# EAGLE design esquematico (EAGLE 8.5.2)
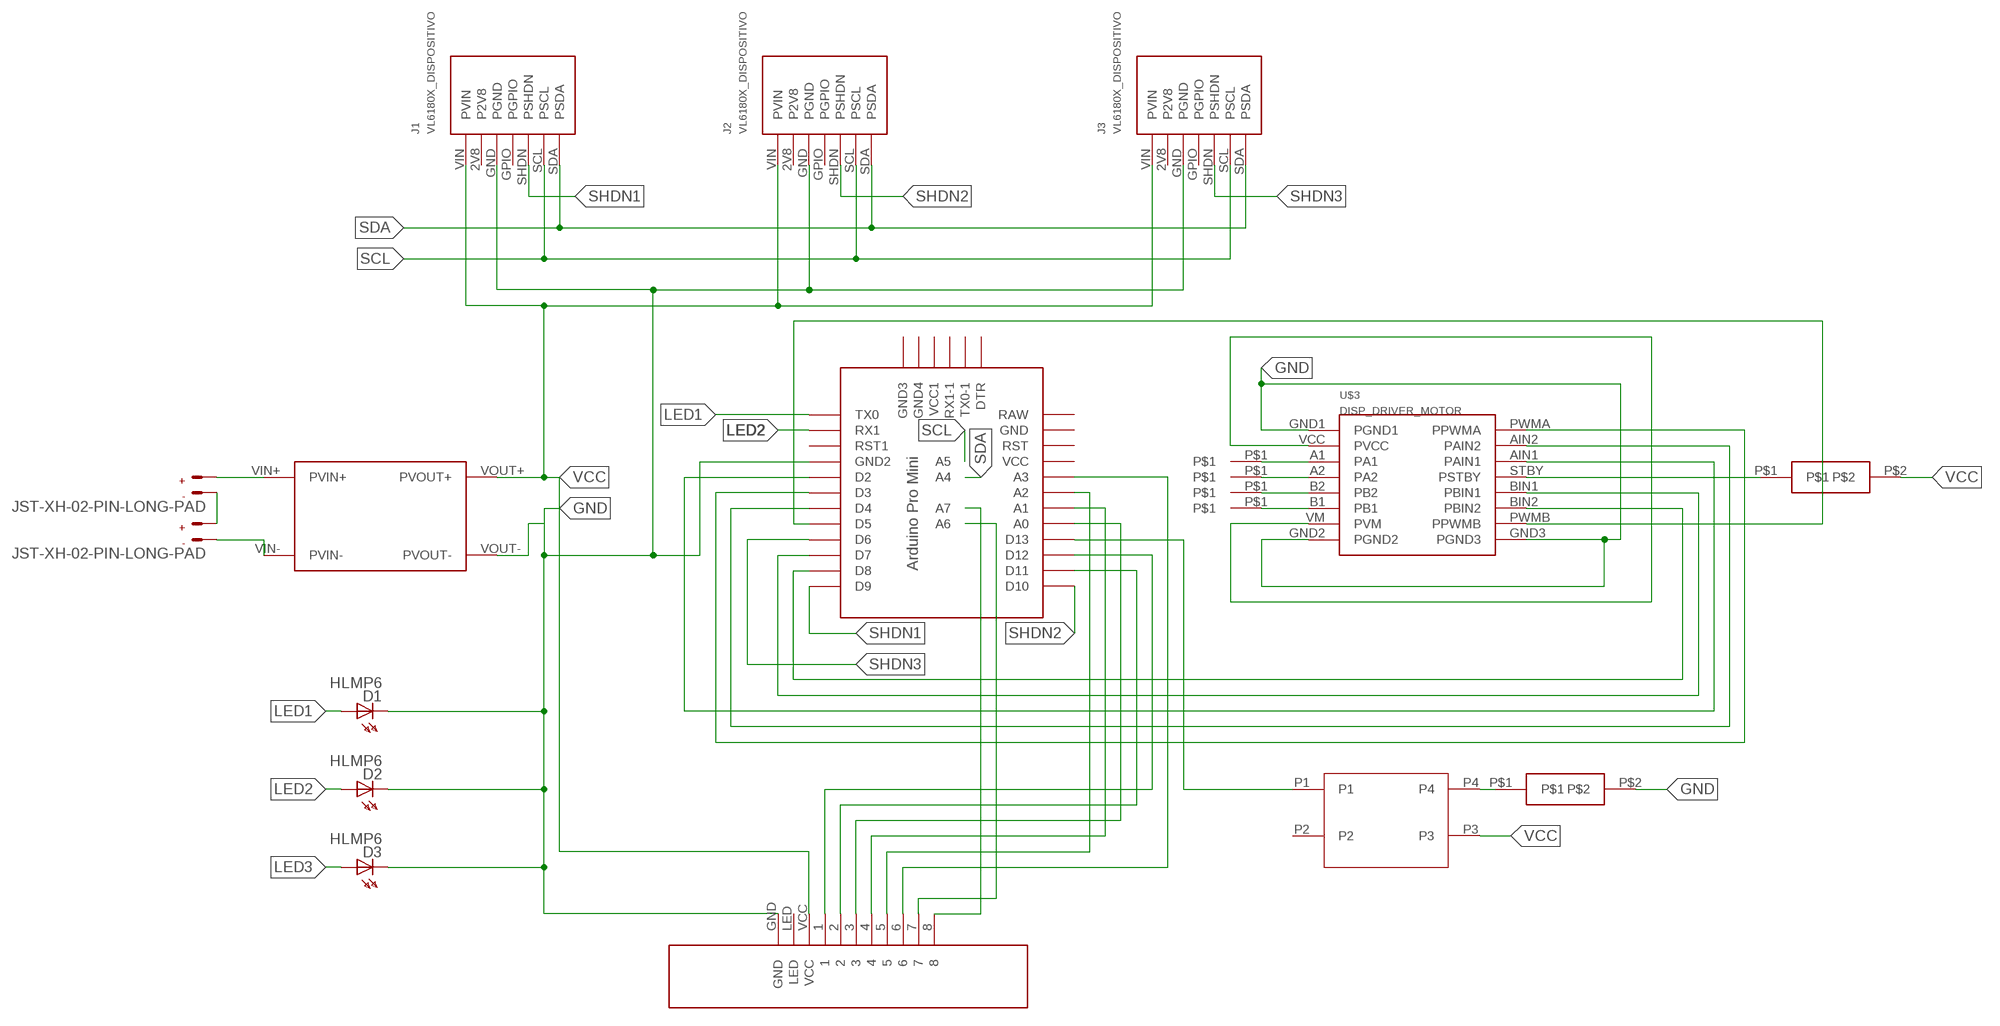
[diagram p0: schematic, sheet 1]

## Parts
D1  HLMP6  [HLMP6]
D2  HLMP6  [HLMP6]
D3  HLMP6  [HLMP6]
DC1+  PION_DVC  [PIN_PKG]
J1  VL6180X_DISPOSITIVO  [VL6180X_PKG]
J2  VL6180X_DISPOSITIVO  [VL6180X_PKG]
J3  VL6180X_DISPOSITIVO  [VL6180X_PKG]
U$1  PRO-MINI-2  [PRO-MINI-2]
U$2  R_BUENO_DIPS  [R_BUENO_PKG]
U$3  DISP_DRIVER_MOTOR  [DRIVER_MOTOR]
U$4  SENSORLINEA_DISP  [SENSORLINEA_PKG]
U$5  RES_DISP  [RES_PKG]
U$6  PION_DVC  [PIN_PKG]
U$7  PION_DVC  [PIN_PKG]
U$8  PION_DVC  [PIN_PKG]
U$9  BOTON_DEVICE  [BOTON_PACK]
U$10  RES_DISP  [RES_PKG]
X1  JST-XH-02-PIN-LONG-PAD  [JST-XH-02-PACKAGE-LONG-PAD]
X2  JST-XH-02-PIN-LONG-PAD  [JST-XH-02-PACKAGE-LONG-PAD]

## Nets
GND: D1.K D2.K D3.K J1.GND J2.GND J3.GND U$1.GND1(GND2) U$2.VOUT- U$3.GND1 U$3.GND2 U$3.GND3 U$4.GND U$10.P$2
LED1: D1.A U$1.TX0
LED2: D2.A U$1.RX1
LED3: D3.A U$1.D13 U$9.P1
N$1: U$2.VIN+ X1.2
N$2: X1.1 X2.2
N$3: U$2.VIN- X2.1
N$4: DC1+.P$1 U$3.A1
N$5: U$3.A2 U$6.P$1
N$6: U$3.B2 U$7.P$1
N$7: U$3.B1 U$8.P$1
N$8: U$3.STBY U$5.P$1
N$9: U$1.D3 U$3.PWMA
N$10: U$1.D4 U$3.AIN2
N$11: U$1.D2 U$3.AIN1
N$12: U$1.D7 U$3.BIN1
N$13: U$1.D8 U$3.BIN2
N$14: U$1.D5 U$3.PWMB
N$15: U$1.D12 U$4.1
N$16: U$1.D11 U$4.2
N$17: U$1.A0 U$4.3
N$18: U$1.A1 U$4.4
N$19: U$1.A2 U$4.5
N$20: U$1.A3 U$4.6
N$21: U$1.A6 U$4.7
N$22: U$1.A7 U$4.8
N$24: U$9.P4 U$10.P$1
SCL: J1.SCL J2.SCL J3.SCL U$1.A5
SDA: J1.SDA J2.SDA J3.SDA U$1.A4
SHDN1: J1.SHDN U$1.D9
SHDN2: J2.SHDN U$1.D10
SHDN3: J3.SHDN U$1.D6
VCC: J1.VIN J2.VIN J3.VIN U$2.VOUT+ U$3.VCC U$3.VM U$4.VCC U$5.P$2 U$9.P3
Unconnected: J1.2V8 J1.GPIO J2.2V8 J2.GPIO J3.2V8 J3.GPIO U$1.DTR U$1.GND U$1.GND2(GND3) U$1.GND3(GND4) U$1.RAW U$1.RST U$1.RST1 U$1.RX1-1 U$1.TX0-1 U$1.VCC U$1.VCC1 U$4.LED U$9.P2

## Library data of the parts
D1-D3 = display-hp:HLMP6: LED 2mm horizontal; MF: AGILENT TECHNOLOGIES; MPN: HLMP-6500; OC_FARNELL: 1652490; OC_NEWARK: 40K0088
DC1+ U$6-U$8 = pin:PION_DVC
J1-J3 = VL6180X_ADAFRUIT:VL6180X_DISPOSITIVO
U$1 = Arduino-clone:PRO-MINI-2: Arduino Pro Mini Layout 2 Sparkfun.com
U$2 = regulador_bueno:R_BUENO_DIPS
U$3 = drivertb6612fng:DISP_DRIVER_MOTOR
U$4 = SENSORLINEA:SENSORLINEA_DISP
U$5 U$10 = res:RES_DISP
U$9 = boton:BOTON_DEVICE
X1 X2 = Rembrandt Electronics - JST XH Connectors v1-0:JST-XH-02-PIN: JST XH Connector 2 Pin Wire to board connector. Pitch: 2,54 mm, (0.100") Number of pins: 2 Created by Rembrandt Electronics www.rembrandtelectronics.com

## Board
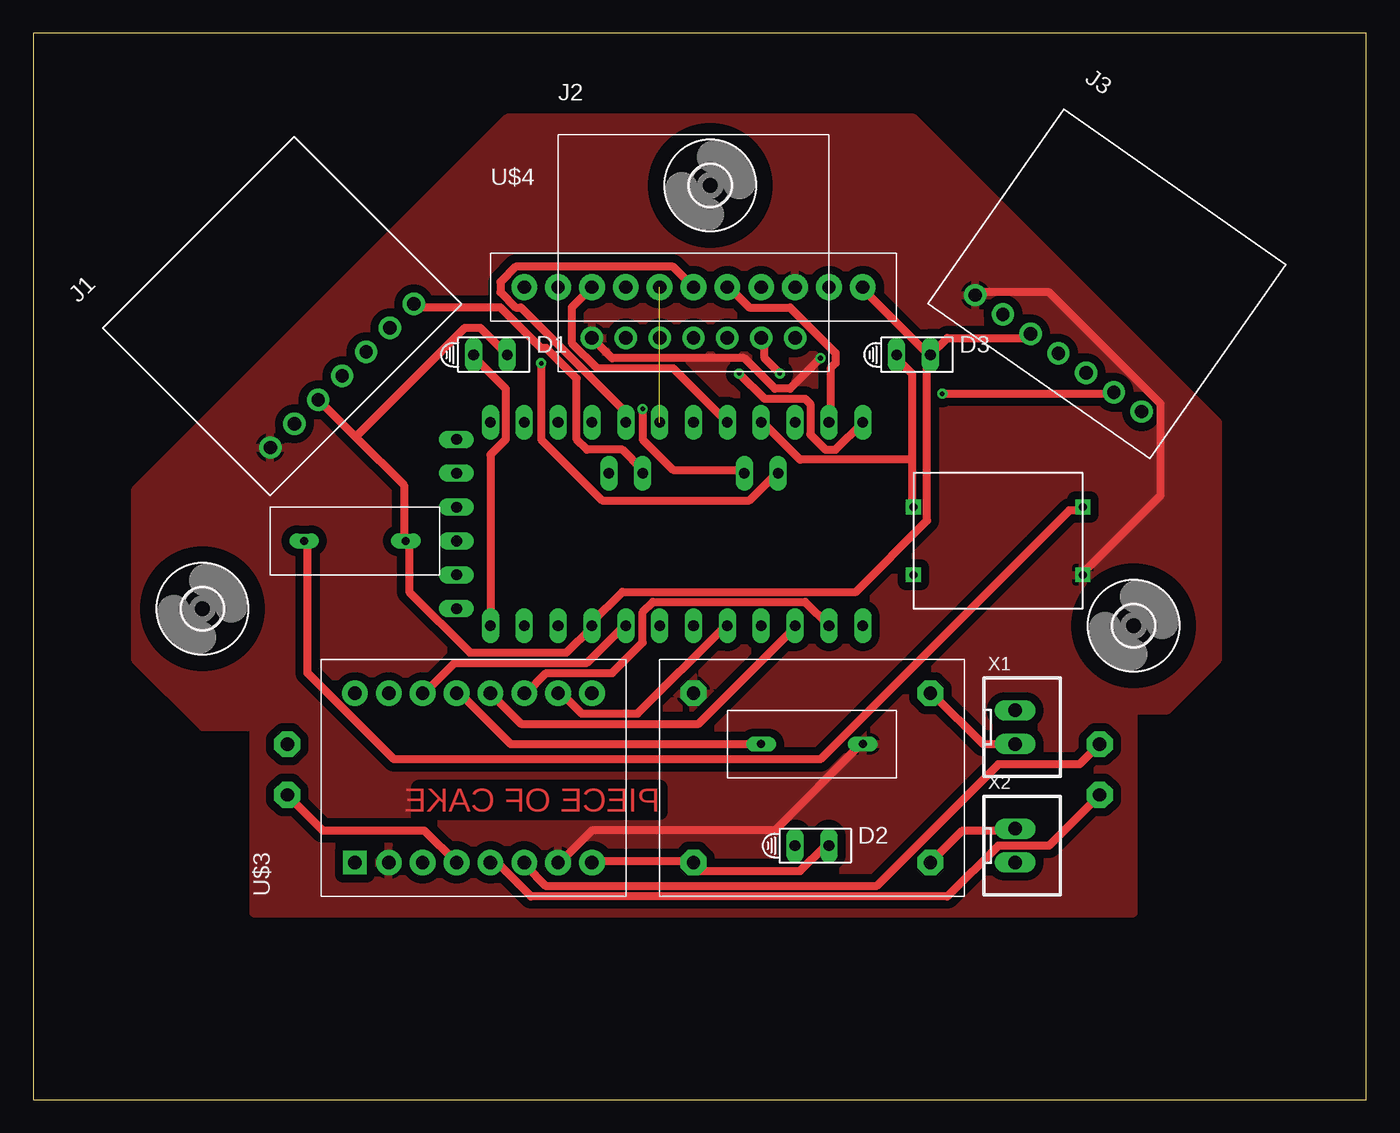
[diagram p1: board, top side]
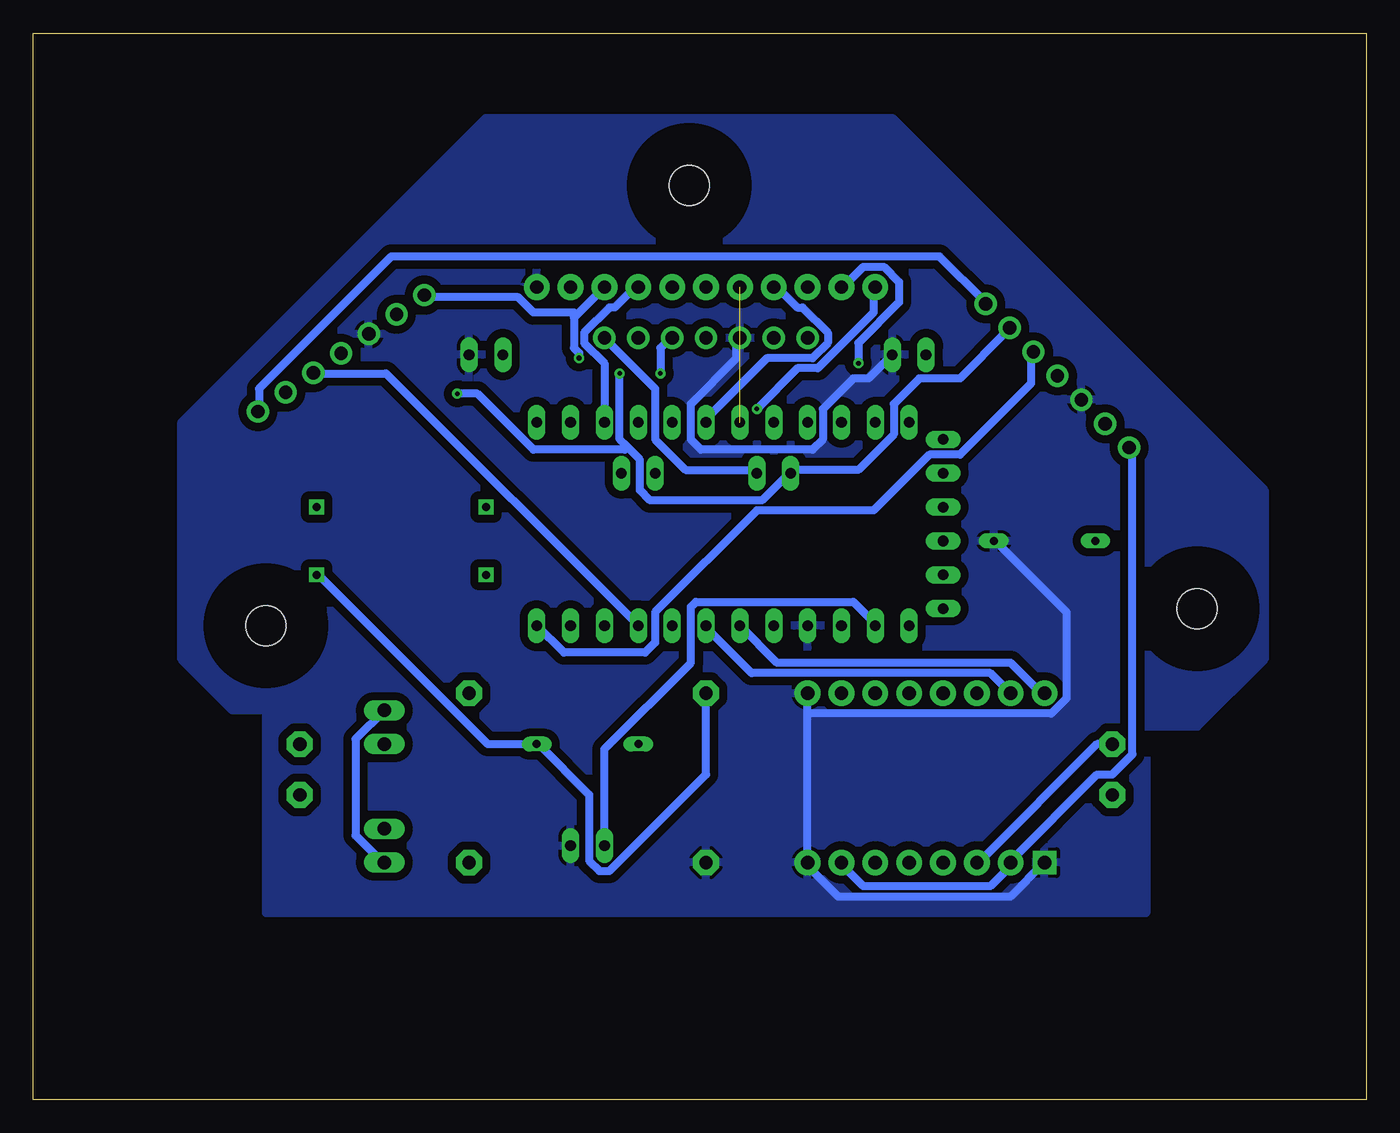
[diagram p2: board, bottom side, seen from below]

Size 100 x 80 mm. Coordinates in mm from the lower left corner, seen from the top.
Outline: 0,0 100,0 100,80 0,80 0,0
Copper layers (1*16): Top 0.035mm / dielectric 1.5mm / Bottom 0.035mm
Design rules "default *": minimum track width 24mil, minimum drill 0.35mm, track to track 6mil, track to pad 6mil, pad to pad 6mil, via to via 6mil, smd to smd 6mil, copper to edge 40mil, drill to drill 6mil, minimum pad ring 10mil, minimum via ring 8mil, stop-mask expansion 4mil, vias tented up to drill 0mil, thermal gap 10mil

### Footprints (pad centres in the part's own frame; a part is rotated, then mirrored left to right if it is on the bottom)
HLMP6 = drill 0.813 long: A -1.27,0; K 1.27,0
PIN_PKG = drill 1 pad 1.93 octagon: P$1 0,0
VL6180X_PKG = drill 1 pad 1.676: 2V8 -5.08,-7.62; GND -2.54,-7.62; GPIO 0,-7.62; SCL 5.08,-7.62; SDA 7.62,-7.62; SHDN 2.54,-7.62; VIN -7.62,-7.62
PRO-MINI-2 = drill 0.8 long: A0 6.35,2.54; A1 6.35,0; A2 6.35,-2.54; A3 6.35,-5.08; A4 2.54,1.27; A5 2.54,3.81; A6 2.54,-8.89; A7 2.54,-6.35; D2 -8.89,2.54; D3 -8.89,0; D4 -8.89,-2.54; D5 -8.89,-5.08; D6 -8.89,-7.62; D7 -8.89,-10.16; D8 -8.89,-12.7; D9 -8.89,-15.24; D10 6.35,-15.24; D11 6.35,-12.7; D12 6.35,-10.16; D13 6.35,-7.62; DTR 5.08,15.24; GND 6.35,10.16; GND1 -8.89,5.08; GND2 -7.62,15.24; GND3 -5.08,15.24; RAW 6.35,12.7; RST 6.35,7.62; RST1 -8.89,7.62; RX1 -8.89,10.16; RX1-1 0,15.24; TX0 -8.89,12.7; TX0-1 2.54,15.24; VCC 6.35,5.08; VCC1 -2.54,15.24
R_BUENO_PKG = drill 1 pad 1.93 octagon: VIN+ 7.62,7.62; VIN- 7.62,-5.08; VOUT+ -10.16,7.62; VOUT- -10.16,-5.08
DRIVER_MOTOR = drill 1 pad 1.93: A1 -7.62,2.54; A2 -7.62,0; AIN1 5.08,2.54; AIN2 5.08,5.08; B1 -7.62,-5.08; B2 -7.62,-2.54; BIN1 5.08,-2.54; BIN2 5.08,-5.08; GND2 -7.62,-10.16; GND3 5.08,-10.16; PWMA 5.08,7.62; PWMB 5.08,-7.62; STBY 5.08,0; VCC -7.62,5.08; VM -7.62,-7.62 | drill 1 pad 1.778 square: GND1 -7.62,7.62
SENSORLINEA_PKG = drill 1 pad 1.93: 1 5.08,-2.54; 2 2.54,-2.54; 3 0,-2.54; 4 -2.54,-2.54; 5 -5.08,-2.54; 6 -7.62,-2.54; 7 -10.16,-2.54; 8 -12.7,-2.54; GND 12.7,-2.54; LED 10.16,-2.54; VCC 7.62,-2.54
RES_PKG = drill 0.6 long: P$1 -5.08,0; P$2 2.54,0
BOTON_PACK = drill 0.6 square: P1 -7.62,2.54; P2 -7.62,-2.54; P3 5.08,-2.54; P4 5.08,2.54
3,0 = hole 3: 0,0
JST-XH-02-PACKAGE-LONG-PAD = drill 1.016 long: 1 -1.27,0; 2 1.27,0

### Placement (x,y rotation side)
D1  34.29,55.88 0 top
D2  58.42,19.05 0 top
D3  66.04,55.88 0 top
DC1+  19.05,26.67 0 top
J1  17.78,59.69 45 top
J2  49.53,64.77 0 top
J3  81.28,62.23 325 top
U$1  46.99,44.45 90 top
U$2  59.69,22.86 0 top
U$3  31.75,25.4 90 top
U$4  49.53,63.5 0 top
U$5  59.69,26.67 0 top
U$6  19.05,22.86 0 top
U$7  80.01,22.86 0 top
U$8  80.01,26.67 0 top
U$9  73.66,41.91 0 top
U$10  25.4,41.91 0 top
U$11  [3,0]  50.8,68.58 0 top
U$12  [3,0]  82.55,35.56 0 top
U$13  [3,0]  12.7,36.83 0 top
X1  73.66,27.94 270 top
X2  73.66,19.05 270 top

### Tracks (layer width: path | path; a pad name or v marks a point on that pad's centre or on a via)
GND
  Top 0.61: D2.K 59.44,19.05 57.53,17.14 49.91,17.14 49.53,17.53 U$2.VOUT- 49.53,17.91 41.91,17.91 U$3.GND2 | D3.K 67.06,56.01 62.1,60.96 U$4.GND | D3.K 68.58,57.15 74.68,57.15 J3.GND | 24.19,49.72 21.72,52.2 J1.GND | 24.19,49.72 27.81,46.1 27.81,41.91 U$10.P$2 28.19,41.91 28.19,38.1 32.77,33.53 40.01,33.53 41.91,35.43 U$1.GND1 41.91,35.81 44.2,38.1 61.72,38.1 67.06,43.43 67.06,55.63 D3.K | D1.K 33.53,57.91 32.38,57.91 24.19,49.72
  Bottom 0.61: U$3.GND1 26.67,15.24 39.62,15.24 41.91,17.53 U$3.GND2 41.91,28.96 | 41.91,28.96 U$3.GND3 | D1.K 37.34,54.1 38.48,54.1 40.77,51.82 40.77,49.53 41.53,48.77 49.91,48.77 50.67,49.53 50.67,52.2 47.24,55.63 47.24,57.15 J2.GND | 41.91,28.96 23.62,28.96 22.48,30.1 22.48,36.58 27.81,41.91 U$10.P$2
  pour Bottom (isolate 0.61): 7.62,45.72 7.62,33.02 12.7,27.94 16.51,27.94 16.51,13.97 82.55,13.97 82.55,29.21 85.09,29.21 88.9,33.02 88.9,50.8 66.04,73.66 35.56,73.66
LED1
  Top 0.61: U$1.TX0 34.29,48.39 35.43,49.53 35.43,53.34 33.15,55.63 D1.A
LED2
  Bottom 0.61: D2.A 57.15,26.29 50.67,32.77 50.67,36.96 50.29,37.34 38.48,37.34 36.96,35.81 U$1.RX1
LED3
  Top 0.61: 65.91,48.01 65.91,54.48 64.77,55.63 D3.A | 65.91,48.01 65.91,44.58 U$9.P1 | 65.91,48.01 57.53,48.01 54.86,50.67 U$1.D13
N$1
  Top 0.61: X1.2 71.25,26.67 67.44,30.48 U$2.VIN+
N$2
  Bottom 0.61: X1.1 75.82,27.05 75.82,19.81 73.91,17.91 X2.2
N$3
  Top 0.61: U$2.VIN- 69.72,20.19 73.53,20.19 X2.1
N$4
  Bottom 0.61: DC1+.P$1 20.19,26.67 28.96,17.91 U$3.A1
N$5
  Top 0.61: U$3.A2 29.34,20.19 21.72,20.19 U$6.P$1
N$6
  Top 0.61: U$7.P$1 76.2,19.05 72.39,19.05 68.58,15.24 37.34,15.24 35.05,17.53 34.29,17.53 U$3.B2
N$7
  Top 0.61: U$8.P$1 78.49,25.15 72.39,25.15 63.25,16 38.48,16 36.96,17.53 U$3.B1
N$8
  Top 0.61: U$5.P$1 35.81,26.67 32,30.48 U$3.STBY
N$9
  Bottom 0.61: U$1.D3 44.2,32.77 26.67,32.77 24.38,30.48 U$3.PWMA
N$10
  Bottom 0.61: U$3.AIN2 28.19,32 46.1,32 49.53,35.43 U$1.D4
N$11
  Top 0.61: U$1.D2 44.2,35.43 41.53,32.77 31.62,32.77 29.34,30.48 U$3.AIN1
N$12
  Top 0.61: U$3.BIN1 36.58,28.19 49.91,28.19 57.15,35.43 U$1.D7
N$13
  Top 0.61: U$1.D8 57.91,37.34 46.48,37.34 45.72,36.58 45.72,34.29 43.43,32 38.48,32 36.96,30.48 U$3.BIN2
N$14
  Top 0.61: U$1.D5 51.82,35.43 45.34,28.96 41.15,28.96 39.62,30.48 U$3.PWMB
N$15
  Bottom 0.61: U$1.D12 57.15,55.24 58.67,56.77 58.67,57.53 56.77,59.44 56.39,59.44 54.86,60.96 U$4.1
N$16
  Top 0.61: U$1.D11 59.82,51.05 59.82,54.86 60.2,55.24 60.2,56.01 56.77,59.44 53.72,59.44 52.2,60.96 U$4.2
N$17
  Top 0.61: U$4.3 48.01,62.48 36.2,62.48 35.05,61.34 35.05,60.58 36.2,59.44 36.58,59.44 44.2,51.82 44.2,51.05 U$1.A0
N$18  (1 unrouted)
N$19
  Bottom 0.61: U$1.A2 49.53,51.05 44.96,55.63 41.53,55.63 40.39,56.77 40.39,57.53 42.29,59.44 42.67,59.44 44.2,60.96 U$4.5
N$20
  Top 0.61: U$1.A3 48.01,54.86 42.29,54.86 40.39,56.77 40.39,59.44 U$4.6
N$21  (via drill 0.35)
  Top 0.61: v38.1,55.24 38.1,49.53 42.67,44.96 53.72,44.96 55.63,46.86 U$1.A6
  Bottom 0.61: v38.1,55.24 38.1,56.77 35.05,59.82 35.05,61.34 36.2,62.48 37.72,62.48 39.24,60.96 U$4.7
N$22  (via drill 0.35)
  Top 0.61: v45.72,51.82 45.72,49.53 48.01,47.24 53.34,47.24 U$1.A7
  Bottom 0.61: v45.72,51.82 42.67,54.86 41.15,54.86 36.96,59.05 36.96,60.96 U$4.8
N$24
  Top 0.61: U$10.P$1 20.57,41.91 20.57,32 27.05,25.53 59.05,25.53 77.72,44.2 78.49,44.2 U$9.P4
SCL  (via drill 0.35)
  Top 0.61: v56.01,54.48 54.86,55.63 54.86,57.15 J2.SCL | v68.2,52.96 80.77,52.96 J3.SCL
  Bottom 0.61: J1.SCL 27.05,57.53 30.48,54.1 33.53,54.1 35.43,52.2 35.43,49.91 38.1,47.24 43.05,47.24 U$1.A5 43.43,46.86 45.34,44.96 53.72,44.96 54.48,45.72 54.48,48.01 55.44,48.96 | v56.01,54.48 56.01,49.53 55.44,48.96 | v68.2,52.96 66.67,52.96 62.48,48.77 55.63,48.77 55.44,48.96
SDA
  Top 0.61: J1.SDA 28.57,59.44 35.05,59.44 38.1,56.39 38.48,56.39 40.77,54.1 40.77,49.53 41.53,48.77 44.2,48.77 45.72,47.24 U$1.A4
  Bottom 0.61: J2.SDA 53.34,53.34 53.34,49.53 51.05,47.24 45.72,47.24 U$1.A4 | J3.SDA 83.06,51.82 83.06,53.34 73.15,63.25 32,63.25 28.57,59.82 J1.SDA
SHDN1
  Bottom 0.61: U$1.D9 60.2,33.53 54.1,33.53 53.34,34.29 53.34,36.58 45.72,44.2 36.96,44.2 32.77,48.39 30.48,48.39 25.15,53.72 25.15,56.01 J1.SHDN
SHDN2  (via drill 0.35)
  Top 0.61: U$1.D10 60.2,48.77 59.44,48.77 58.29,49.91 58.29,52.2 57.91,52.58 54.86,52.58 v52.96,54.48
  Bottom 0.61: v52.96,54.48 52.96,56.39 52.2,57.15 J2.SHDN
SHDN3
  Bottom 0.61: U$1.D6 73.53,54.48 78.87,54.48 J3.SHDN
VCC  (via drill 0.35)
  Top 0.61: J2.VIN 43.43,55.63 53.34,55.63 55.63,53.34 56.77,53.34 v59.05,55.63 | J3.VIN 70.87,60.58 76.2,60.58 84.58,52.2 84.58,45.34 78.87,39.62 U$9.P3 | U$3.VM 39.62,17.91 41.91,20.19 55.63,20.19 62.1,26.67 U$5.P$2
  Bottom 0.61: J1.VIN 17.53,48.77 17.53,25.91 19.05,24.38 20.19,24.38 26.67,17.91 U$3.VCC 26.67,17.53 28.19,16 37.72,16 39.24,17.53 U$3.VM | v59.05,55.63 59.05,56.01 59.44,56.39 59.44,58.67 59.24,58.86 | U$4.VCC 59.24,58.86 | J3.VIN 70.48,60.2 63.63,60.2 62.48,59.05 59.44,59.05 59.24,58.86 | U$9.P3 78.49,39.24 65.91,26.67 U$5.P$2 62.1,26.67 58.29,22.86 58.29,17.91 57.53,17.14 56.77,17.14 49.53,24.38 U$2.VOUT+
  pour Top (isolate 0.61): 17.78,13.97 82.55,13.97 82.55,29.21 85.09,29.21 88.9,33.02 88.9,50.8 72.39,67.31 66.04,73.66 35.56,73.66 7.62,45.72 7.62,33.02 12.7,27.94 16.51,27.94 16.51,13.97

### Text on the board
Top: PIECE OF CAKE